# Altium project WT108.PrjPcb
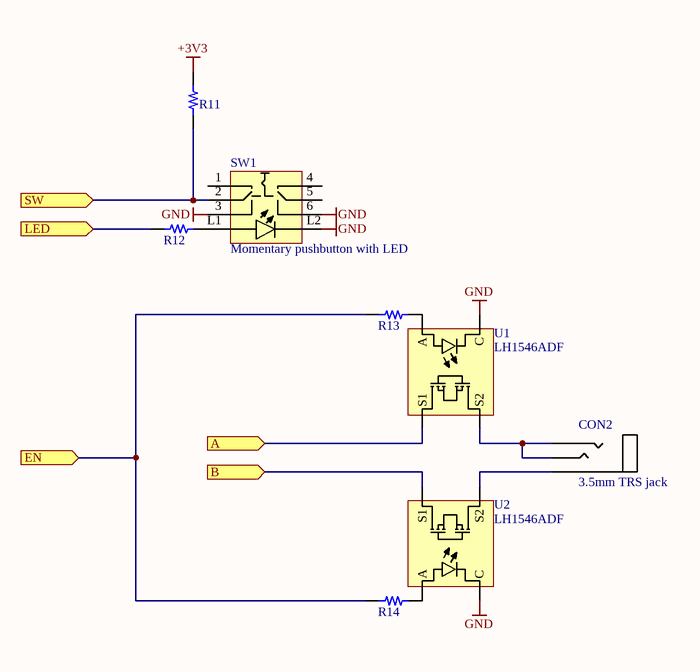
[diagram p0: WT108_Output.schdoc]
2 sheets, 16 parts. Net scope: flat (ports and power ports of the same name join across sheets).
Board file: WT108.PcbDoc
Sheets:
  WT108_Output.schdoc
  WT108_SIPO.schdoc

## Sheet WT108_Output.schdoc
size A4

### Parts
CON2  3.5mm TRS jack  [3.5mm socket, side mount]
R11  10 kOhms  [RES 0603_1608]  (value not drawn)
R12  120 Ohms  [RES 0603_1608]  (value not drawn)
R13  120 Ohms  [RES 0603_1608]  (value not drawn)
R14  120 Ohms  [RES 0603_1608]  (value not drawn)
SW1  Momentary pushbutton with LED  [Switch_with_LED]
U1  LH1546ADF  [LH1546]
U2  LH1546ADF  [LH1546]

### Ports
A (in), B (in), EN (in), LED (in), SW (in)

### Nets
+3V3: R11.2
GND: SW1.3 SW1.6 SW1.L2(C) U1.2(C) U2.2(C)
NetCON2_R: CON2.R CON2.T U1.3(S2)
NetCON2_S: CON2.S U2.3(S2)
NetR11_1: R11.1 SW1.2 ; port SW
NetR12_1: R12.1 ; port LED
NetR12_2: R12.2 SW1.L1(A)
NetR13_1: R13.1 R14.1 ; port EN
NetR13_2: R13.2 U1.1(A)
NetR14_2: R14.2 U2.1(A)
NetU1_4: U1.4(S1) ; port A
NetU2_4: U2.4(S1) ; port B

Not connected (* = marked no-connect by the designer): SW1 1(7) 4 5

### Notes on the sheet
- Title
- Size:
- Project:
- A4
- Date:
- Revision:
- Sheet
- of
- Wendy
- Teslaburger
- File:

### Library data of the parts
R11 = RT0603DRD0710KL: RES SMD 10K OHM 0.5% 1/10W 0603; Manufacturer: Yageo; Power (Watts): 0.1W, 1/10W; Temperature Coefficient: ±25ppm/°C; ComponentLink1Description: Datasheet; ComponentLink1URL: https://www.yageo.com/upload/media/product/productsearch/datasheet/rchip/PYu-RT_1-to-0.01_RoHS_L_11.pdf; ComponentLink2Description: DigiKey Link; ComponentLink2URL: http://digikey.com/product-detail/en/yageo/RT0603DRD0710KL/311-10KDCT-ND/1035680; Composition: Thin Film; Device Package: 0603 (1608 Metric); Height - Seated (Max): 0.022" (0.55mm); LastUpdated: 02/09/2020 01:10:23; Lifecycle Status: Active; Part Number: RT0603DRD0710KL; Minimum Order: 1; Number of Terminations: 2; Operating Temperature: -55°C ~ 155°C; Package / Case: 0603 (1608 Metric); Packaging: TapeAndReel; PartId: 5487; Part Status: Active; Price: 0.02; Resistance: 10 kOhms; Series: RT; Size / Dimension: 0.063" L x 0.031" W (1.60mm x 0.80mm); Supplier 1: DigiKey; Supplier Part Number 1: 311-10KDCT-ND; Supplier Device Package: 0603; Tolerance: ±0.5%; Value: 10 kOhms
R12-R14 = RT0603DRE07120RL: RES SMD 120 OHM 0.5% 1/10W 0603; Manufacturer: Yageo; Power (Watts): 0.1W, 1/10W; Temperature Coefficient: ±50ppm/°C; ComponentLink1Description: Datasheet; ComponentLink1URL: https://www.yageo.com/upload/media/product/productsearch/datasheet/rchip/PYu-RT_1-to-0.01_RoHS_L_11.pdf; ComponentLink2Description: DigiKey Link; ComponentLink2URL: http://digikey.com/product-detail/en/yageo/RT0603DRE07120RL/311-2409-1-ND/6128828; Composition: Thin Film; Device Package: 0603 (1608 Metric); Height - Seated (Max): 0.022" (0.55mm); LastUpdated: 02/09/2020 01:10:15; Lifecycle Status: Active; Part Number: RT0603DRE07120RL; Minimum Order: 1; Number of Terminations: 2; Operating Temperature: -55°C ~ 155°C; Package / Case: 0603 (1608 Metric); Packaging: TapeAndReel; PartId: 9567; Part Status: Active; Price: 0.01; Resistance: 120 Ohms; Series: RT; Size / Dimension: 0.063" L x 0.031" W (1.60mm x 0.80mm); Supplier 1: DigiKey; Supplier Part Number 1: 311-2409-1-ND; Supplier Device Package: 0603; Tolerance: ±0.5%; Value: 120 Ohms
SW1 = MCPSD7x
U1 U2 = LH1546ADF: 1 Form A Solid-State Relay (Normally Open) 22Ohm 350V

## Sheet WT108_SIPO.schdoc
size A4
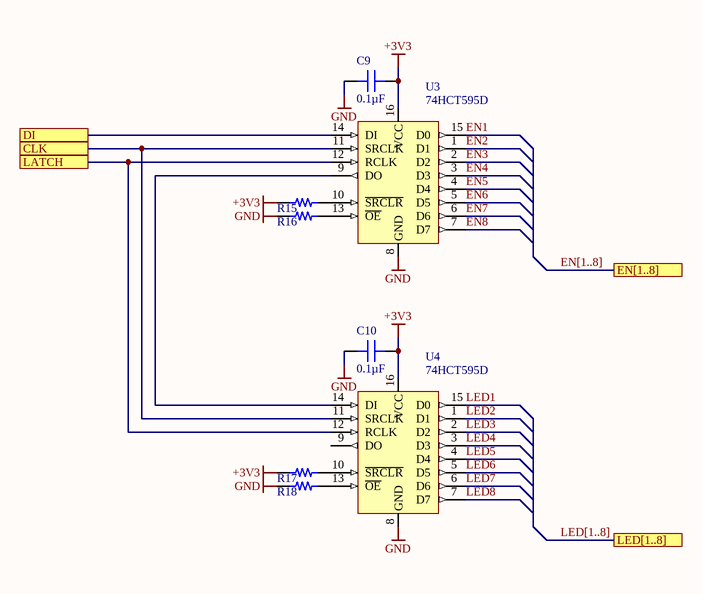
[diagram p1: WT108_SIPO.schdoc]

### Parts
C9  0.1µF  [CAP 0603_1608]
C10  0.1µF  [CAP 0603_1608]
R15  10 kOhms  [RES 0603_1608]  (value not drawn)
R16  10 kOhms  [RES 0603_1608]  (value not drawn)
R17  10 kOhms  [RES 0603_1608]  (value not drawn)
R18  10 kOhms  [RES 0603_1608]  (value not drawn)
U3  74HCT595D  [SOP65P780X180-16N]
U4  74HCT595D  [SOP65P780X180-16N]

### Ports
CLK, DI, EN[1..8], LATCH, LED[1..8]

### Nets
+3V3: C9.1 C10.1 R15.1 R17.1 U3.16(VCC) U4.16(VCC)
GND: C9.2 C10.2 R16.1 R18.1 U3.8(GND) U4.8(GND)
EN1: U3.15(D0)
EN2: U3.1(D1)
EN3: U3.2(D2)
EN4: U3.3(D3)
EN5: U3.4(D4)
EN6: U3.5(D5)
EN7: U3.6(D6)
EN8: U3.7(D7)
LED1: U4.15(D0)
LED2: U4.1(D1)
LED3: U4.2(D2)
LED4: U4.3(D3)
LED5: U4.4(D4)
LED6: U4.5(D5)
LED7: U4.6(D6)
LED8: U4.7(D7)
NetR15_2: R15.2 U3.10(~{SRCLR})
NetR16_2: R16.2 U3.13(~{OE})
NetR17_2: R17.2 U4.10(~{SRCLR})
NetR18_2: R18.2 U4.13(~{OE})
NetU3_9: U3.9(DO) U4.14(DI)
NetU3_11: U3.11(SRCLK) U4.11(SRCLK) ; port CLK
NetU3_12: U3.12(RCLK) U4.12(RCLK) ; port LATCH
NetU3_14: U3.14(DI) ; port DI

Not connected (* = marked no-connect by the designer): U4 9(DO)

### Buses and harness runs
bus EN[1..8] = port EN[1..8]
bus LED[1..8] = port LED[1..8]

### Notes on the sheet
- Title
- Size:
- Project:
- A4
- Date:
- Revision:
- Sheet
- of
- Wendy
- Teslaburger
- File:

### Library data of the parts
C9 C10 = C0603C104K5RAC7411: CAP CER 0.1UF 50V X7R 0603; Manufacturer: KEMET; Tolerance: ±10%; Applications: Bypass, Decoupling; Capacitance: 0.1µF; ComponentLink1Description: Datasheet; ComponentLink1URL: https://api.kemet.com/component-edge/download/datasheet/C0603C104K5RAC7411.pdf; ComponentLink2Description: DigiKey Link; ComponentLink2URL: http://digikey.com/product-detail/en/kemet/C0603C104K5RAC7411/399-7374-2-ND/3317013; Device Package: 0603 (1608 Metric); LastUpdated: 02/09/2020 01:03:36; Lifecycle Status: Active; Part Number: C0603C104K5RAC7411; Minimum Order: 15000; Mounting Type: Surface Mount, MLCC; Operating Temperature: -55°C ~ 125°C; Package / Case: 0603 (1608 Metric); Packaging: TapeAndReel; PartId: 2233; Part Status: Active; Price: 0.02; Series: SMD Comm X7R; Size / Dimension: 0.063" L x 0.031" W (1.60mm x 0.80mm); Supplier 1: DigiKey; Supplier Part Number 1: 399-7374-2-ND; Temperature Coefficient: X7R; Thickness (Max): 0.035" (0.90mm); Value: 0.1µF; Voltage - Rated: 50V
R15-R18 = RT0603DRD0710KL: as R11 on sheet WT108_Output; ComponentLink1Description: Datasheet; ComponentLink1URL: https://www.yageo.com/upload/media/product/productsearch/datasheet/rchip/PYu-RT_1-to-0.01_RoHS_L_11.pdf; ComponentLink2Description: DigiKey Link; ComponentLink2URL: http://digikey.com/product-detail/en/yageo/RT0603DRD0710KL/311-10KDCT-ND/1035680; Composition: Thin Film; Device Package: 0603 (1608 Metric); Height - Seated (Max): 0.022" (0.55mm); LastUpdated: 02/09/2020 01:10:23; Lifecycle Status: Active; Part Number: RT0603DRD0710KL; Minimum Order: 1; Number of Terminations: 2; Operating Temperature: -55°C ~ 155°C; Package / Case: 0603 (1608 Metric); Packaging: TapeAndReel; PartId: 5487; Part Status: Active; Price: 0.02; Resistance: 10 kOhms; Series: RT; Size / Dimension: 0.063" L x 0.031" W (1.60mm x 0.80mm); Supplier 1: DigiKey; Supplier Part Number 1: 311-10KDCT-ND; Supplier Device Package: 0603; Tolerance: ±0.5%; Value: 10 kOhms
U3 U4 = 74HCT595D: 8-Bit Serial-Input Parallel-Output; Price: 0.171; Supplier 1: Farnell; Supplier Part Number 1: 2724128

## Nets that join several sheets
+3V3: WT108_Output (R11.2), WT108_SIPO (6 pins)
GND: WT108_Output (5 pins), WT108_SIPO (6 pins)